# EAGLE design lsm9ds0-breakout (EAGLE 6.5.0)
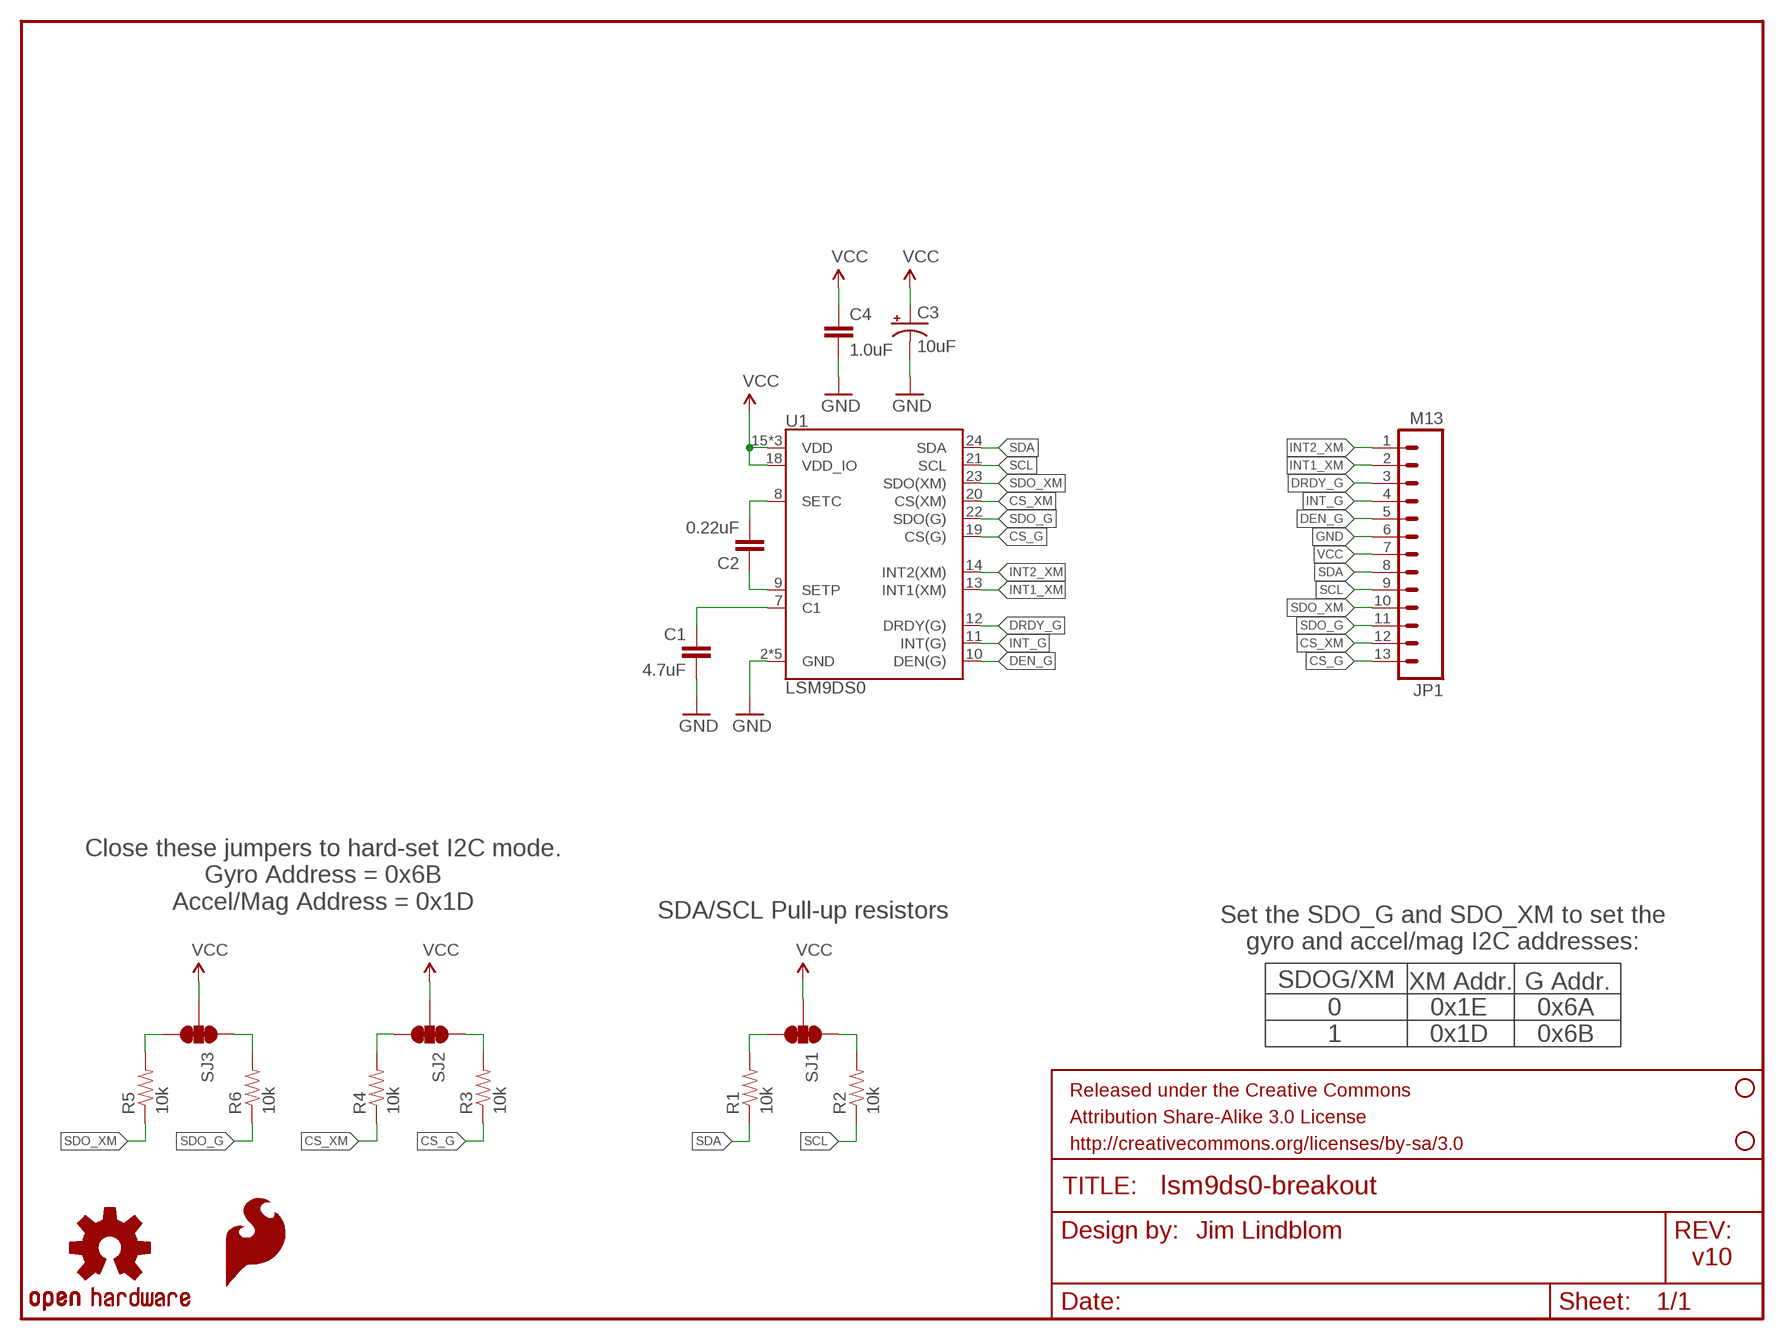
[diagram p0: schematic, sheet 1]

## Parts
C1  4.7uF  4.7UF-6.3V-10%(0603)0603  [0603-CAP]
C2  0.22uF  0.22UF-25V-10%(0603)  [0603-CAP]
C3  10uF  10UF-16V-10%(TANT)  [EIA3216]
C4  1.0uF  1.0UF-16V-10%(0603)  [0603-CAP]
FRAME1  FRAME-LETTER  [CREATIVE_COMMONS]
JP1  M13  [1X13]
LOGO1  OSHW-LOGOS  [OSHW-LOGO-S]
LOGO2  SFE_LOGO_FLAME.1_INCH  [SFE_LOGO_FLAME_.1]
LOGO3  SFE_LOGO_FLAME.1_INCH  [SFE_LOGO_FLAME_.1]
R1  10k  10K-1%RES-00824  [0603-RES]
R2  10k  10K-1%RES-00824  [0603-RES]
R3  10k  10K-1%RES-00824  [0603-RES]
R4  10k  10K-1%RES-00824  [0603-RES]
R5  10k  10K-1%RES-00824  [0603-RES]
R6  10k  10K-1%RES-00824  [0603-RES]
SJ1  SOLDERJUMPER_2WAYS  [SJ_3]
SJ2  SOLDERJUMPER_2WAYS  [SJ_3]
SJ3  SOLDERJUMPER_2WAYS  [SJ_3]
STANDOFF1  STAND-OFF  [STAND-OFF]
STANDOFF2  STAND-OFF  [STAND-OFF]
U1  LSM9DS0  [LGA-24]

## Nets
CS_G: JP1.13 R3.1 U1.19(CS(G))
CS_XM: JP1.12 R4.1 U1.20(CS(XM))
DEN_G: JP1.5 U1.10(DEN(G))
DRDY_G: JP1.3 U1.12(DRDY(G))
GND: C1.2 C3.C(-) C4.2 JP1.6 U1.2(GND) U1.3(GND) U1.4(GND) U1.5(GND) U1.6(GND)
INT1_XM: JP1.2 U1.13(INT1(XM))
INT2_XM: JP1.1 U1.14(INT2(XM))
INT_G: JP1.4 U1.11(INT(G))
N$1: C2.1 U1.9(SETP)
N$2: C2.2 U1.8(SETC)
N$3: C1.1 U1.7(C1)
N$4: R3.2 SJ2.1
N$5: R4.2 SJ2.3
N$6: R1.2 SJ1.3
N$7: R2.2 SJ1.1
N$12: R5.2 SJ3.3
N$13: R6.2 SJ3.1
SCL: JP1.9 R2.1 U1.21(SCL)
SDA: JP1.8 R1.1 U1.24(SDA)
SDO_G: JP1.11 R6.1 U1.22(SDO(G))
SDO_XM: JP1.10 R5.1 U1.23(SDO(XM))
VCC: C3.A(+) C4.1 JP1.7 SJ1.2 SJ2.2 SJ3.2 U1.15(VDD) U1.16(VDD) U1.17(VDD) U1.18(VDD_IO)

## Notes on the sheet
- Close these jumpers to hard-set I2C mode.
  Gyro Address = 0x6B
  Accel/Mag Address = 0x1D
- SDA/SCL Pull-up resistors
- Set the SDO_G and SDO_XM to set the
  gyro and accel/mag I2C addresses:
- SDOG/XM | XM Addr. | G Addr.
- 0
  1
- 0x1E
  0x1D
- 0x6A
  0x6B
- Jim Lindblom
- v10

## Library data of the parts
C1 = SparkFun-Capacitors:4.7UF-6.3V-10%(0603): CAP-08280; PROD_ID: CAP-08280
C2 = SparkFun-Capacitors:0.22UF-25V-10%(0603): CAP-07822; PROD_ID: CAP-07822
C3 = SparkFun-Capacitors:10UF-16V-10%(TANT): CAP-00811 1206/EIA-3216 Tantalum capacitor; PROD_ID: CAP-00811
C4 = SparkFun-Capacitors:1.0UF-16V-10%(0603): CAP-00868; PROD_ID: CAP-00868
FRAME1 = SparkFun-Aesthetics:FRAME-LETTER: Schematic Frame Standard 8.5x11 US Letter frame
JP1 = SparkFun-Connectors:M13: 13-pin single row .1" header
LOGO1 = SparkFun-Aesthetics:OSHW-LOGO: Open Source Hardware Logo This logo indicates the piece of hardware it is found on incorporates a OSHW license and/or adheres to the definition of open source hardware found here: http://freedomdefined.org/OSHW
LOGO2 LOGO3 = SparkFun-Aesthetics:SFE_LOGO_FLAME: SFE Logo, flame only This is the SparkFun flame logo. The logo on the schematic will always be the same size; the package variant is the height of the flame. Default layer for the logo on the board is tSilk.
R1-R6 = SparkFun-Resistors:10K-1%: 10k-ohm SMT 1/10W - 1% (0603) RES-00824; PROD_ID: RES-00824
SJ1-SJ3 = SparkFun-Passives:SOLDERJUMPER_2WAY: Solder Jumper 2 way solder jumper
STANDOFF1 STANDOFF2 = SparkFun-Electromechanical:STAND-OFF: #4 Stand Off This is the mechanical footprint for a #4 phillips button head screw. Use the keepout ring to avoid running the screw head into surrounding components. SKU : PRT-00447
U1 = SparkFun-DigitalIC:LSM9DS0: LSM9DS0 3D Accelerometer, 3D Gyroscope, 3D Magnetomter Features: 3 acceleration channels, 3 angular rate channels, 3 magnetic field channels ±2/±4/±6/±8/±16 g linear acceleration full scale ±2/±4/±8/±12 gauss magnetic full scale ±245/±500/±2000 dps angular rate full scale 16-bit data output SPI / I2C serial interfaces Analog supply voltage 2.4 V to 3.6 V Power-down mode / low-power mode Programmable interrupt generators Embedded self-test Embedded temperature sensor Embedded FIFO Position and motion detection functions Click/double-click recognition

## Board
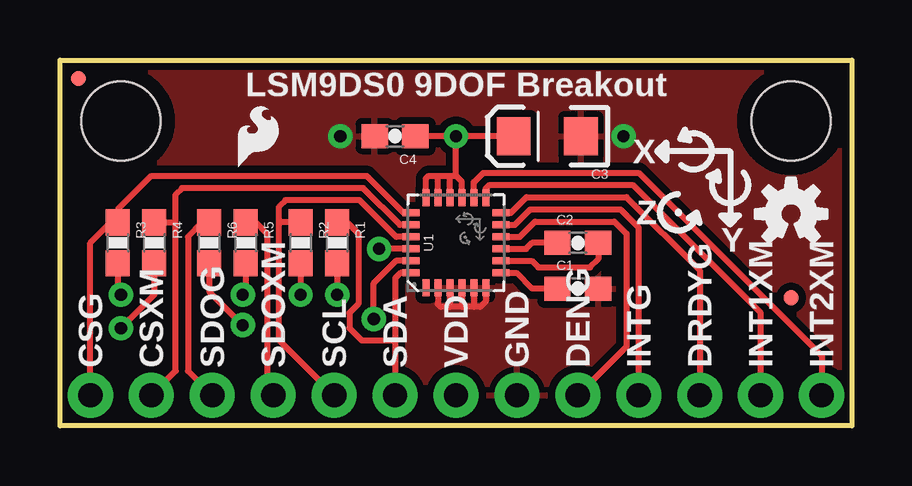
[diagram p1: board, top side]
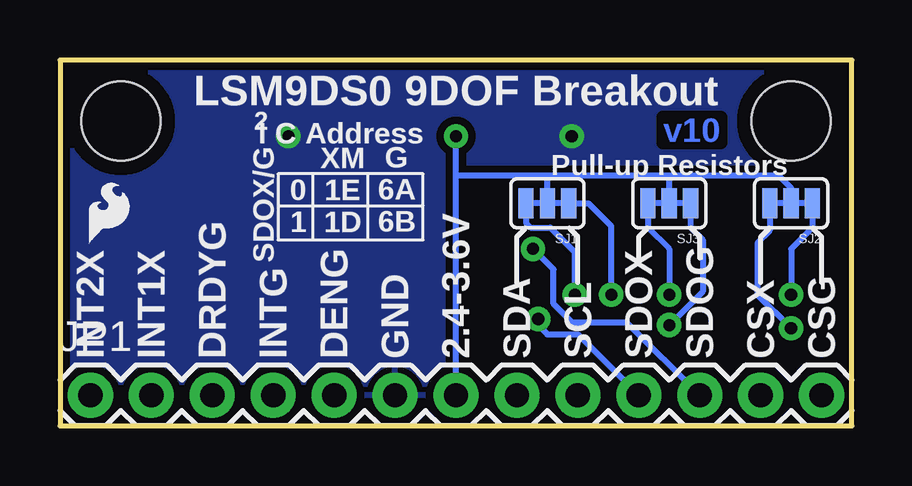
[diagram p2: board, bottom side, seen from below]

Size 33.02 x 15.24 mm. Coordinates in mm from the lower left corner, seen from the top.
Outline: 0,0 0,15.24 33.02,15.24 33.02,0 0,0
Copper layers (1*16): Top 0.035mm / dielectric 1.5mm / Bottom 0.035mm
Design rules "SparkFun *": minimum track width 7mil, minimum drill 15mil, track to track 8mil, track to pad 8mil, pad to pad 8mil, via to via 8mil, smd to smd 8mil, copper to edge 8mil, drill to drill 8mil, minimum pad ring 12mil, minimum via ring 10mil, stop-mask expansion 4mil, vias tented up to drill 20mil, thermal gap 10mil
tRestrict: area 15.2,6.3 to 17.8,8.9

### Footprints (pad centres in the part's own frame; a part is rotated, then mirrored left to right if it is on the bottom)
0603-CAP = smd 1.1 x 1: 1 -0.85,0; 2 0.85,0
EIA3216 = smd 1.4 x 1.6: A 1.4,0; C -1.4,0
MICRO-FIDUCIAL = smd 0.635 x 0.635: 1 0,0
1X13 = drill 1.016 pad 1.88: 1 0,0; 2 2.54,0; 3 5.08,0; 4 7.62,0; 5 10.16,0; 6 12.7,0; 7 15.24,0; 8 17.78,0; 9 20.32,0; 10 22.86,0; 11 25.4,0; 12 27.94,0; 13 30.48,0
0603-RES = smd 1.1 x 1: 1 -0.85,0; 2 0.85,0
SJ_3 = smd 0.635 x 1.27: 1 -0.889,0; 2 0,0; 3 0.889,0
STAND-OFF = hole 3.302: 0,0
LGA-24 = smd 0.7 x 0.29: 1 -1.875,1.25; 2 -1.875,0.75; 3 -1.875,0.25; 4 -1.875,-0.25; 5 -1.875,-0.75; 6 -1.875,-1.25; 13 1.875,-1.25; 14 1.875,-0.75; 15 1.875,-0.25; 16 1.875,0.25; 17 1.875,0.75; 18 1.875,1.25 | smd 0.29 x 0.7: 7 -1.25,-1.875; 8 -0.75,-1.875; 9 -0.25,-1.875; 10 0.25,-1.875; 11 0.75,-1.875; 12 1.25,-1.875; 19 1.25,1.875; 20 0.75,1.875; 21 0.25,1.875; 22 -0.25,1.875; 23 -0.75,1.875; 24 -1.25,1.875

### Placement (x,y rotation side)
C1  21.59,5.71 0 top
C2  21.59,7.62 0 top
C3  20.32,12.06 180 top
C4  13.97,12.06 180 top
FID1  FIDUCIALUFIDUCIAL  [MICRO-FIDUCIAL]  30.48,5.33 0 top
FID2  FIDUCIALUFIDUCIAL  [MICRO-FIDUCIAL]  0.76,14.48 0 top
FRAME1  22.86,-27.94 0 top  (outside the outline)
JP1  31.75,1.27 0 bottom
LOGO1  30.48,8.83 0 top
LOGO2  32.13,7.24 0 bottom
LOGO3  7.11,10.41 0 top
R1  11.56,7.62 270 top
R2  10.03,7.62 270 top
R3  2.41,7.62 270 top
R4  3.94,7.62 270 top
R5  7.75,7.62 270 top
R6  6.22,7.62 270 top
SJ1  12.7,9.27 180 bottom
SJ2  2.54,9.27 180 bottom
SJ3  7.62,9.27 180 bottom
STANDOFF1  2.54,12.7 0 top
STANDOFF2  30.48,12.7 0 top
U1  16.51,7.62 90 top

### Tracks (layer width: path | path; a pad name or v marks a point on that pad's centre or on a via)
CS_G
  Top 0.254: JP1.13 1.27,7.62 2.12,8.47 R3.1 2.41,9.02 3.81,10.41 12.79,10.41 14.33,8.87 U1.19
CS_XM
  Top 0.254: JP1.12 4.83,2.29 4.83,8.38 | 4.83,8.38 4.83,9.64 5.09,9.91 12.64,9.91 14.17,8.37 U1.20 | R4.1 4.74,8.47 4.83,8.38
DEN_G
  Top 0.254: U1.10 19.17,7.87 19.81,8.51 23.11,8.51 23.62,8 23.62,3.3 JP1.5
DRDY_G
  Top 0.254: JP1.3 26.67,6.48 23.62,9.53 19.46,9.53 18.8,8.87 U1.12
GND  (via drill 0.51)
  Top 0.254: U1.2 15.76,5.07 15.88,4.95 16.26,4.95 | U1.3 16.26,4.96 16.26,4.95 | U1.6 17.76,5.19 17.53,4.95 17.27,4.95 | 17.27,4.95 16.76,4.95 | 16.76,4.95 16.26,4.95 | U1.4 16.76,4.96 16.76,4.95 | U1.5 17.26,4.96 17.27,4.95
  other vias: 23.5,12.06 11.68,12.06
  pour Bottom (isolate 0.305): 0,0 0,15.24 33.02,15.24 33.02,0
  pour Top (isolate 0.305): 0,0 0,15.24 33.02,15.24 33.02,0
INT1_XM
  Top 0.254: U1.13 17.76,9.89 17.91,10.03 23.88,10.03 29.21,4.7 JP1.2
INT2_XM
  Top 0.254: U1.14 17.26,10.15 17.65,10.54 24.13,10.54 31.75,2.92 JP1.1
INT_G
  Top 0.254: U1.11 18.96,8.37 19.61,9.02 23.37,9.02 24.13,8.26 JP1.4
N$1
  Top 0.254: U1.9 19.43,7.37 19.68,7.62 C2.1
N$2
  Top 0.254: U1.8 19.67,6.87 19.94,6.6 22.1,6.6 22.44,6.95 C2.2
N$3
  Top 0.254: U1.7 19.03,6.37 19.68,5.71 C1.1
N$4  (via drill 0.51)
  Top 0.254: R3.2 2.41,5.59 v2.54,5.46
  Bottom 0.254: SJ2.1 1.65,8.26 2.54,7.37 v2.54,5.46
N$5  (via drill 0.51)
  Top 0.254: R4.2 3.94,5.46 v2.54,4.06
  Bottom 0.254: SJ2.3 3.43,8.13 3.94,7.62 3.94,5.46 v2.54,4.06
N$6  (via drill 0.51)
  Top 0.254: R1.2 v11.56,5.46
  Bottom 0.254: v11.56,5.46 11.56,7.24 12.57,8.26 13.4,8.26 13.59,8.45 SJ1.3
N$7  (via drill 0.51)
  Top 0.254: R2.2 v10.03,5.46
  Bottom 0.254: v10.03,5.46 10.03,8.32 10.99,9.27 SJ1.1
N$8
  Bottom 0.254: 1.78,9.27 2.41,9.27
N$9
  Bottom 0.254: 2.67,9.27 3.3,9.27
N$10
  Bottom 0.254: 6.86,9.27 7.49,9.27
N$11
  Bottom 0.254: 7.75,9.27 8.38,9.27
N$12  (via drill 0.51)
  Top 0.254: R5.2 7.75,5.59 v7.62,5.46
  Bottom 0.254: SJ3.3 8.51,8.26 7.62,7.37 v7.62,5.46
N$13  (via drill 0.51)
  Top 0.254: R6.2 6.22,5.59 v7.62,4.19
  Bottom 0.254: SJ3.1 6.73,8.26 6.22,7.75 6.22,5.59 v7.62,4.19
N$14
  Bottom 0.254: 11.94,9.27 12.57,9.27
N$15
  Bottom 0.254: 12.83,9.27 13.46,9.27
SCL
  Top 0.254: JP1.9 9.14,3.56 9.14,8.51 | 9.14,8.51 9.14,9.14 9.4,9.4 12.48,9.4 14.01,7.87 U1.21 | 9.14,8.51 9.18,8.47 R2.1
SDA
  Top 0.254: 13.97,3.56 13.97,6.15 14.19,6.37 U1.24 | 13.97,3.56 JP1.8 | 13.97,3.56 12.57,3.56 12.06,4.06 12.06,4.7 12.45,5.08 12.45,8 11.98,8.47 R1.1
SDO_G  (via drill 0.51)
  Top 0.254: R6.1 5.93,8.47 5.33,7.87 5.33,2.29 JP1.11 | U1.22 v13.3,7.37
  Bottom 0.254: JP1.11 9.4,4.32 11.68,4.32 12.45,5.08 12.45,6.51 v13.3,7.37
SDO_XM  (via drill 0.51)
  Top 0.254: R5.1 8.17,8.47 8.64,8 8.64,1.52 JP1.10 | U1.23 14.01,6.87 13.08,5.94 v13.08,4.45
  Bottom 0.254: v13.08,4.45 13.08,4.19 12.7,3.81 11.43,3.81 JP1.10
VCC  (via drill 0.51)
  Top 0.254: v16.51,12.06 C4.1 | C3.A v16.51,12.06 | U1.15 16.76,10.16 16.51,10.41 | 16.51,10.41 v16.51,12.06 | U1.18 15.26,10.31 15.37,10.41 15.75,10.41 | 15.75,10.41 16.26,10.41 | 16.26,10.41 16.51,10.41 | U1.17 15.76,10.4 15.75,10.41 | U1.16 16.26,10.41
  Bottom 0.254: 16.51,10.41 v16.51,12.06 | 7.62,10.41 3.05,10.41 2.54,9.91 SJ2.2 | 7.62,10.41 12.7,10.41 | 12.7,10.41 16.51,10.41 | JP1.7 16.51,10.41 | SJ1.2 12.7,10.41 | SJ3.2 7.62,10.41

### Text on the board
Bottom: v10
tPlace: LSM9DS0 9DOF Breakout | X | Z | Y | CSG | CSXM | SDOG | SDOXM | SCL | SDA | VDD | GND | DENG | INTG | DRDYG | INT1XM | INT2XM
bPlace: LSM9DS0 9DOF Breakout | 2 | I C Address | Pull-up Resistors | G / 6A / 6B | XM / 1E / 1D | 0 / 1 | SDOX/G | CSG | CSX | SDOG | SDOX | SCL | SDA | 2.4-3.6V | GND | DENG | INTG | DRDYG | INT1X | INT2X
tDocu: Jim Lindblom